# Altium schematic sheet ps2_interface.SchDoc
size A4; SheetNumber: 5; SheetTotal: 5
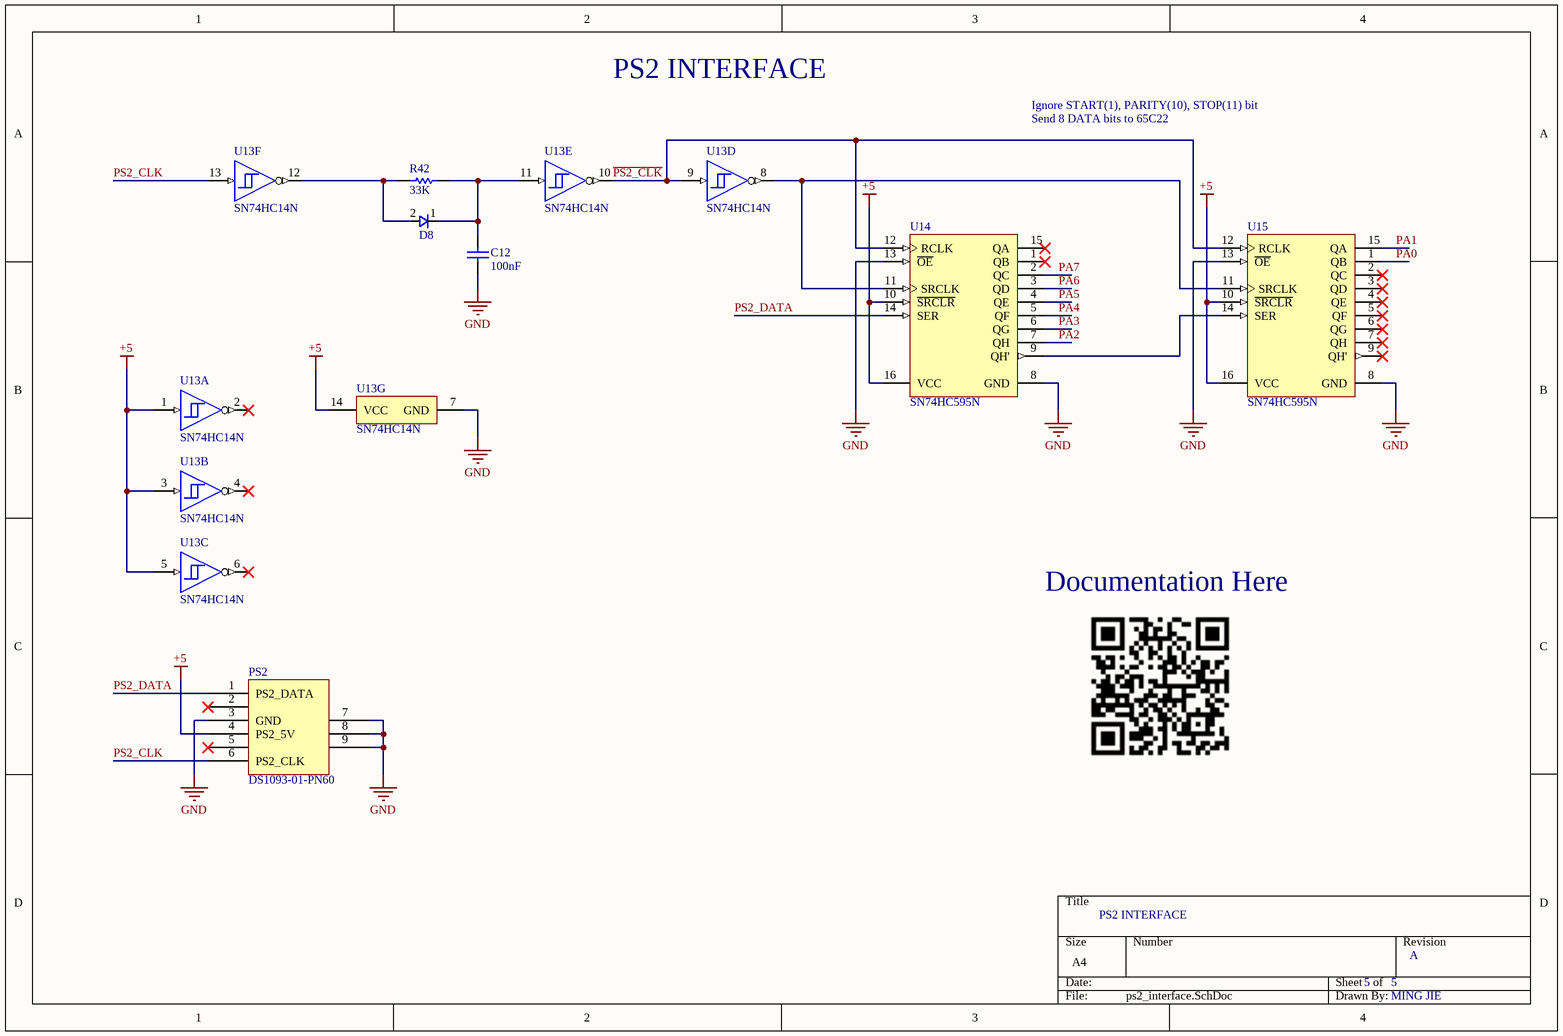
[diagram p0: ps2_interface.SchDoc]

## Parts
C12  Capacitance: 100nF  [CAPC2013X135X45ML10T25]  (hidden comment: GRM21BR71H104KA01L)
D8  Diode, General Purpose  [DO-214AC/SMA]  (value not drawn)
PS2  DS1093-01-PN60  [PS2_PORT]
R42  Resistance: 33K  [RESC2013X50X30NL20T20]  (hidden comment: 0805W8F3302T5E)
U13  SN74HC14N  [N0014A]  (parts A,B,C,D,E,F,G of 7)
U14  SN74HC595N  [N0016A]
U15  SN74HC595N  [N0016A]

## Nets
+5: PS2.4(PS2_5V) U13.1(1A) U13.3(2A) U13.5(3A) U13.14(VCC) U14.10(~{SRCLR}) U14.16(VCC) U15.10(~{SRCLR}) U15.16(VCC)
GND: C12.2 PS2.3(GND) PS2.7 PS2.8 PS2.9 U13.7(GND) U14.8(GND) U14.13(~{OE}) U15.8(GND) U15.13(~{OE})
~{PS2_CLK}: U13.9(4A) U13.10(~{5Y}) U14.12(RCLK) U15.12(RCLK)
PA0: U15.1(QB)
PA1: U15.15(QA)
PA2: U14.7(QH)
PA3: U14.6(QG)
PA4: U14.5(QF)
PA5: U14.4(QE)
PA6: U14.3(QD)
PA7: U14.2(QC)
PS2_CLK: PS2.6(PS2_CLK) U13.13(6A)
PS2_DATA: PS2.1(PS2_DATA) U14.14(SER)
NetC12_1: C12.1 D8.1 R42.2 U13.11(5A)
NetD8_2: D8.2 R42.1 U13.12(~{6Y})
NetU13_8: U13.8(~{4Y}) U14.11(SRCLK) U15.11(SRCLK)
NetU14_9: U14.9(QH') U15.14(SER)

Not connected (* = marked no-connect by the designer): PS2 2* 5*; U13 2(~{1Y})* 4(~{2Y})* 6(~{3Y})*; U14 1(QB)* 15(QA)*; U15 2(QC)* 3(QD)* 4(QE)* 5(QF)* 6(QG)* 7(QH)* 9(QH')*

## Notes on the sheet
- PS2 INTERFACE
- Ignore START(1), PARITY(10), STOP(11) bit
- Send 8 DATA bits to 65C22
- Documentation Here
- 5
- A
- MING JIE

## Library data of the parts
C12 = CMP-2100-03644-1: Chip Capacitor, 0.1 uF, +/- 10%, 50 V, -55 to 125 degC, 0805 (2012 Metric), RoHS, Tape and Reel; Manufacturer: Murata; Voltage: 50V; Insulation Resistance: 10GR; Dielectric Material: Ceramic; Dielectric: X7R; Package Description: 2-Pin Surface Mount Device, Body 2 x 1.25 mm; Manufacturer URL: http://www.murata.com/; Case Code (Imperial): 0805; Datasheet URL: http://psearch.en.murata.com/capacitor/product/GRM21BR71H104KA01%23.pdf; Termination: SMD/SMT; Lead Free: LeadFree; Package Quantity: 1; Mount: SurfaceMount; REACH SVHC: Unknown; Thickness: 0.053inch; Height: 1.25mm; Case/Package: 0805; Voltage Rating: 50V; Width: 0.049inch; Case Code (Metric): 2012; Material: Ceramic; Min Operating Temperature: -55degC; RoHSCompliant: true; Datasheet Version: 42675.0; Voltage Rating (DC): 50V; Tolerance: 10%; Package Reference: 0805; Depth: 1.25mm; Length: 2mm; Max Operating Temperature: 125degC; Packaging: TapeandReel; Number of Pins: 2; Radiation Hardening: No
D8 = C95872: General Purpose Diode, SMT, DO-214
PS2 = PS2_CONN: PS2 Port
R42 = CMP-1013-00510-2: 33K, 0805 Chip Resistor, UniOhm; Part Number: 0805W8F3302T5E; Manufacturer: Uni Ohm
U13 = CMP-1615-00889-3: Hex Schmitt-Trigger Inverters, N0014A, TUBE; Manufacturer: Texas Instruments; Input Type: CMOS; Voltage(Nom)(V): 5; VCC(Min)(V): 2; tpd @ Nom Voltage(Max)(ns): 31; Technology Family: HC; VCC(Max)(V): 6; F @ Nom Voltage(Max)(Mhz): 20; Output Drive (IOL/IOH)(Max)(mA): -4/4; Rating: Catalog; Schmitt Trigger: Yes; ICC @ Nom Voltage(Max)(mA): 0.02; PackageReference: N0014A; Code_JEDEC: MS-001; Operating Temperature Range(C): -40 to 85; Generic Part Number: SN74HC14; Bits(#): 6; DatasheetVersion: SCLS085G; Output Type: CMOS
U14 U15 = CMP-0780-00137-3: 8-Bit Shift Registers With 3-State Output Registers, N0016A, TUBE; Manufacturer: Texas Instruments; F @ Nom Voltage(Max)(Mhz): 28; Input Type: CMOS; Bits: 8; VCC(Min)(V): 2; 3-State Output: Yes; ICC @ Nom Voltage(Max)(mA): 0.08; VCC(Max)(V): 6; tpd @ Nom Voltage(Max)(ns): 34; Rating: Military; Technology Family: HC; Output Drive (IOL/IOH)(Max)(mA): 7.8/-7.8; Code_JEDEC: MS-001; Output Type: CMOS; Operating Temperature Range(C): -40 to 85; Voltage(Nom)(V): 6; Generic Part Number: SN74HC595; DatasheetVersion: SCLS041H; PackageReference: N0016A; PackageVersion: http://www.ti.com/lit/ml/mpdi002c/mpdi002c.pdf